# EasyEDA schematic Hochbeet_2020-04-23_13-35-51.json
TITLE: Hochbbeet; REV: 1.0; Date: 2020-04-23; Sheet: 1/1; Drawn By: Stefan Burkhardt; Company: Private
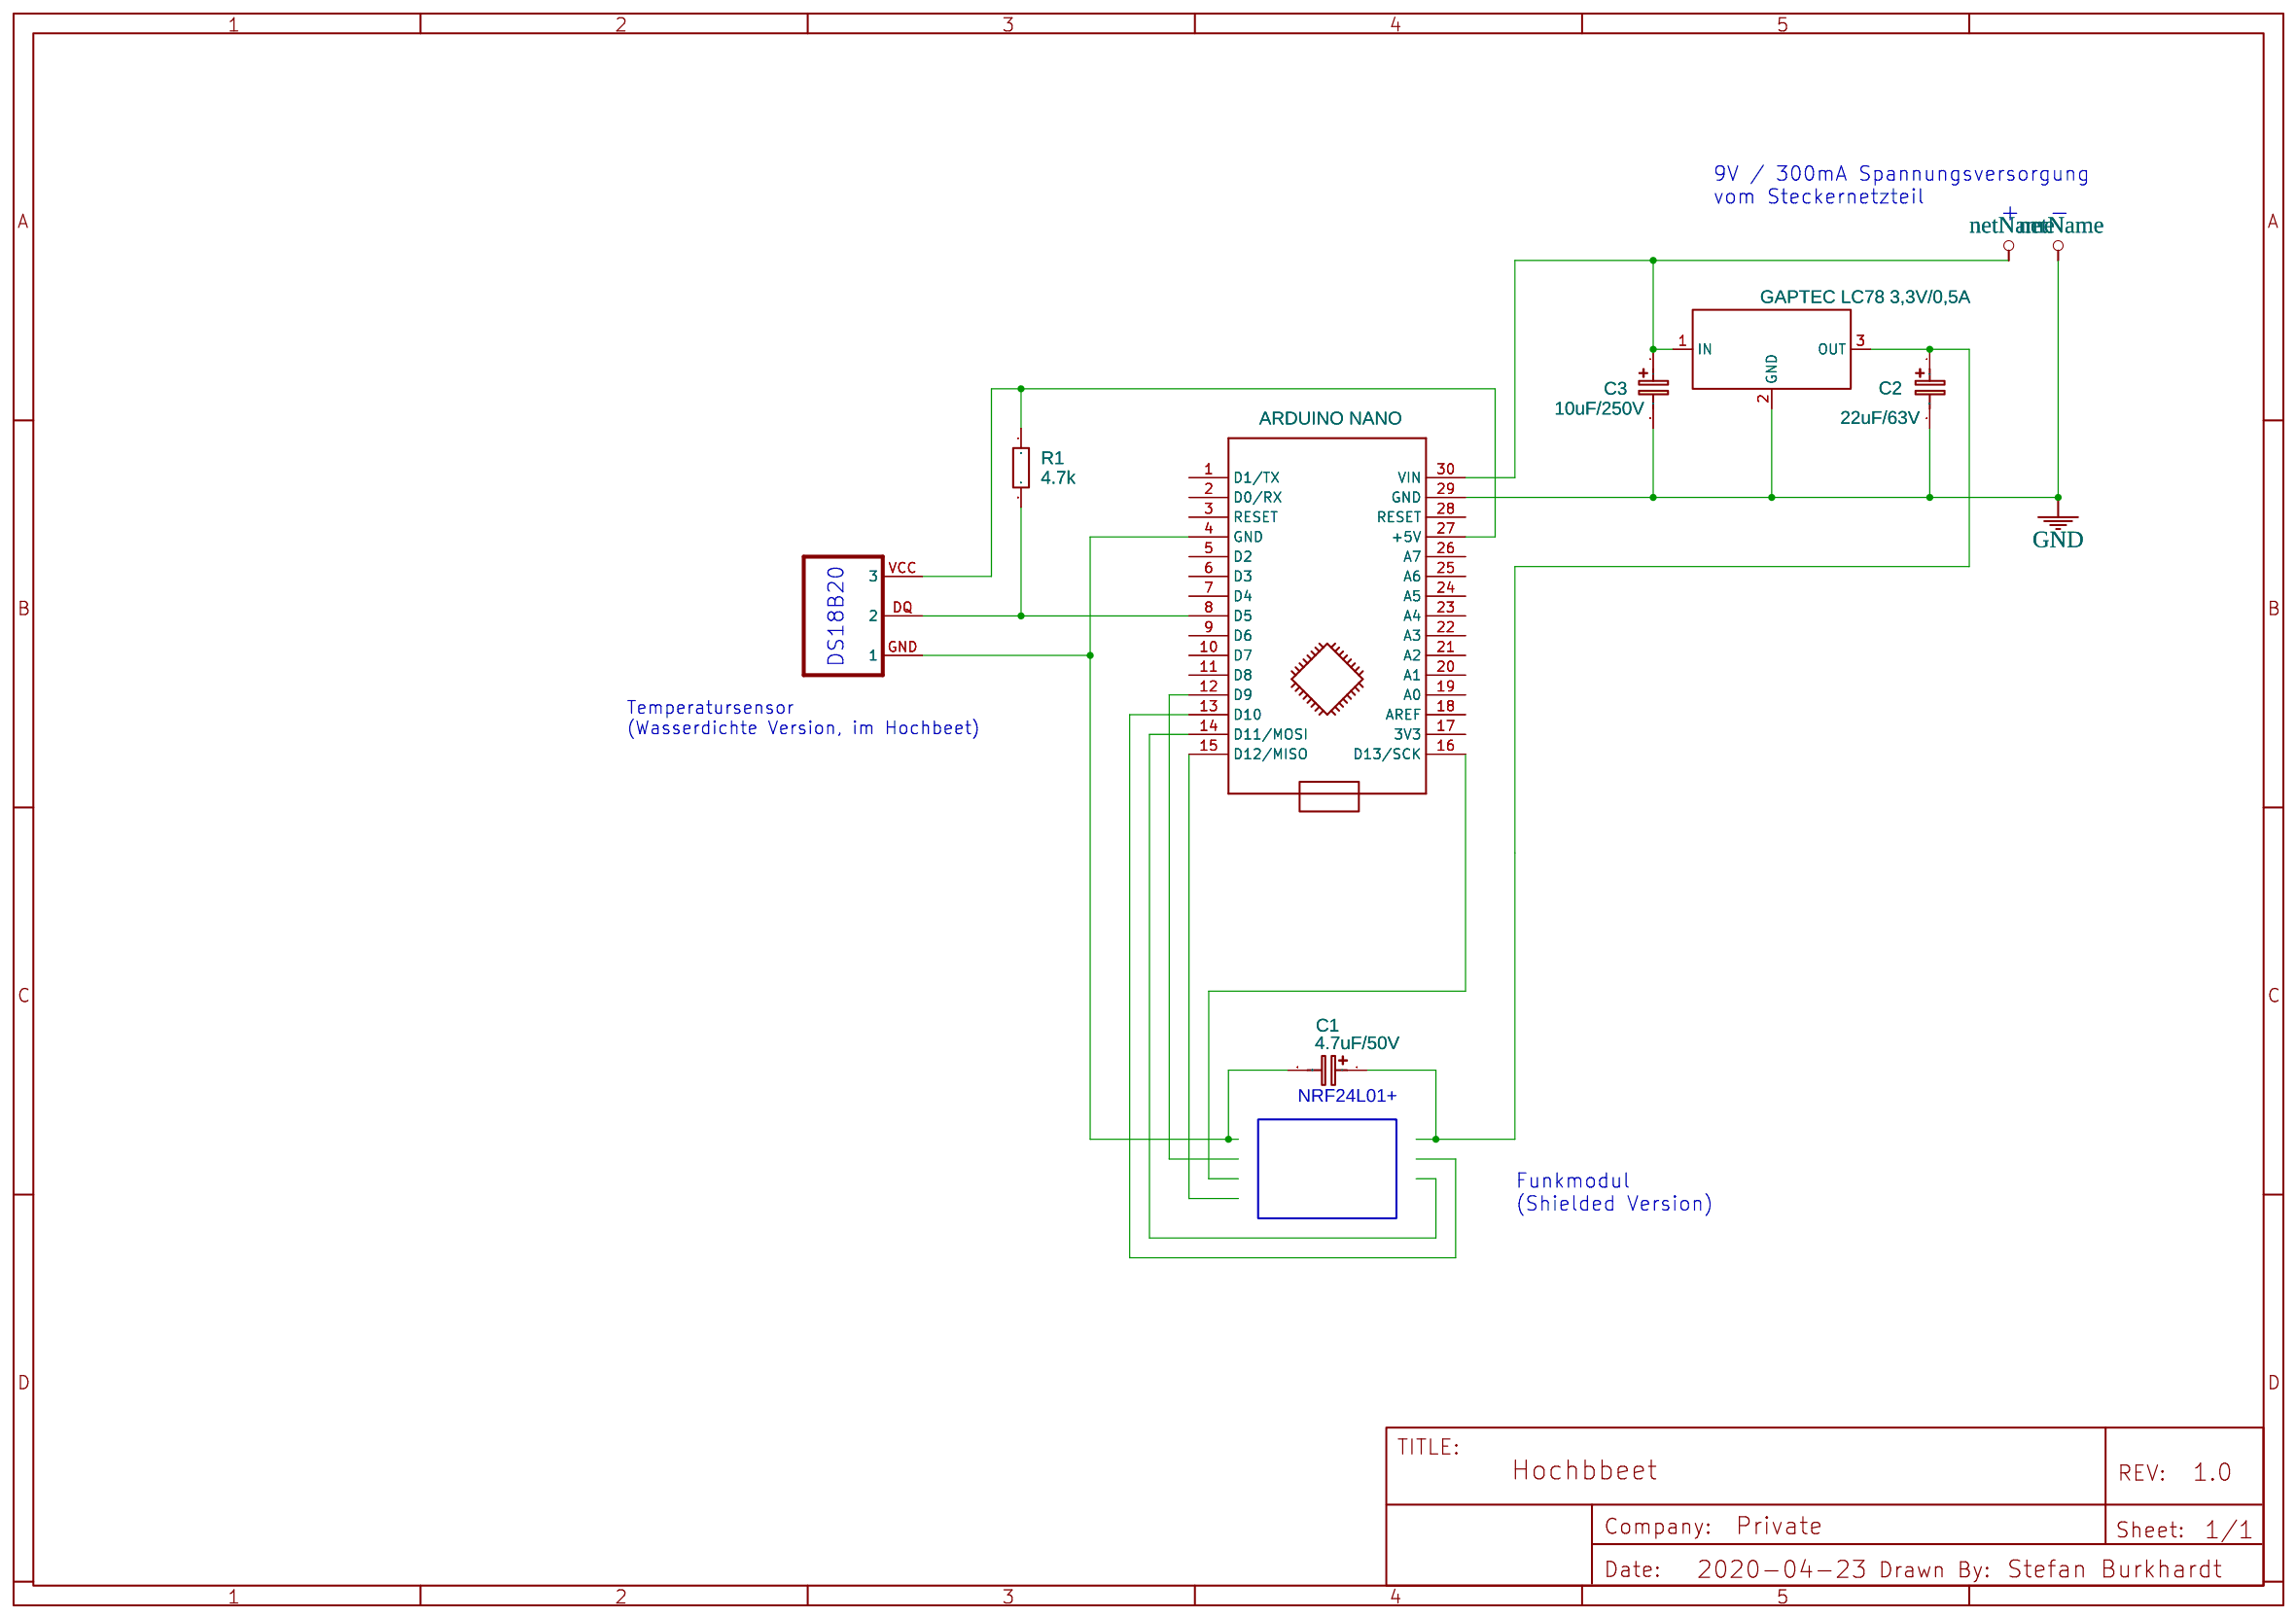
[diagram p0: schematic sheet]

## Parts
C1  4.7uF/50V  [CAP-D3.0XF1.5]
C2  22uF/63V  [CAP-D3.0XF1.5]
C3  10uF/250V  [CAP-D3.0XF1.5]
R1  4.7k  [AXIAL-0.3]
U1  ARDUINO NANO  [ARDUINO_NANO]
U2  DS18B20  [DIP]
U4  GAPTEC LC78 3,3V/0,5A  [GAPTEC_LC78]

## Library data of the parts
C1-C3 = Cap_Electrolytic(TH)_D3.0XF1.5_EU: Contributor: EasyEDA; Manufacturer Part: ?
R1 = Res_AXIAL-0.3(1/8W)_EU: Manufacturer Part: ?
U1 = -: sourceId: KGSeAWhDB; Manufacturer Part: ?
U2 = -: Contributor: HGY; Manufacturer Part: ?
U4 = -: Manufacturer Part: ?; Contributor: kbasten

## Nets
GND: C2.2 C3.1 C3.2 U1.29(GND) U1.30(VIN) U4.1(IN) U4.2(GND)
Net-(C1-1): C1.1 C2.1 U4.3(OUT)
Net-(C1-2): C1.2 U1.4(GND) U2.GND(1)
Net-(R1-1): R1.1 U1.27(+5V) U2.VCC(3)
Net-(R1-2): R1.2 U1.8(D5) U2.DQ(2)

Not connected (* = marked no-connect by the designer): U1 1(D1/TX) 2(D0/RX) 3(RESET) 5(D2) 6(D3) 7(D4) 9(D6) 10(D7) 11(D8) 12(D9) 13(D10) 14(D11/MOSI) 15(D12/MISO) 16(D13/SCK) 17(3V3) 18(AREF) 19(A0) 20(A1) 21(A2) 22(A3) 23(A4) 24(A5) 25(A6) 26(A7) 28(RESET)

## Notes on the sheet
- 9V / 300mA Spannungsversorgung
  vom Steckernetzteil
- +
- -
- DS18B20
- Temperatursensor
  (Wasserdichte Version, im Hochbeet)
- NRF24L01+
- Funkmodul
  (Shielded Version)
